# Altium schematic sheet AD7768_hall_crossboard_1_1.SchDoc
size A4
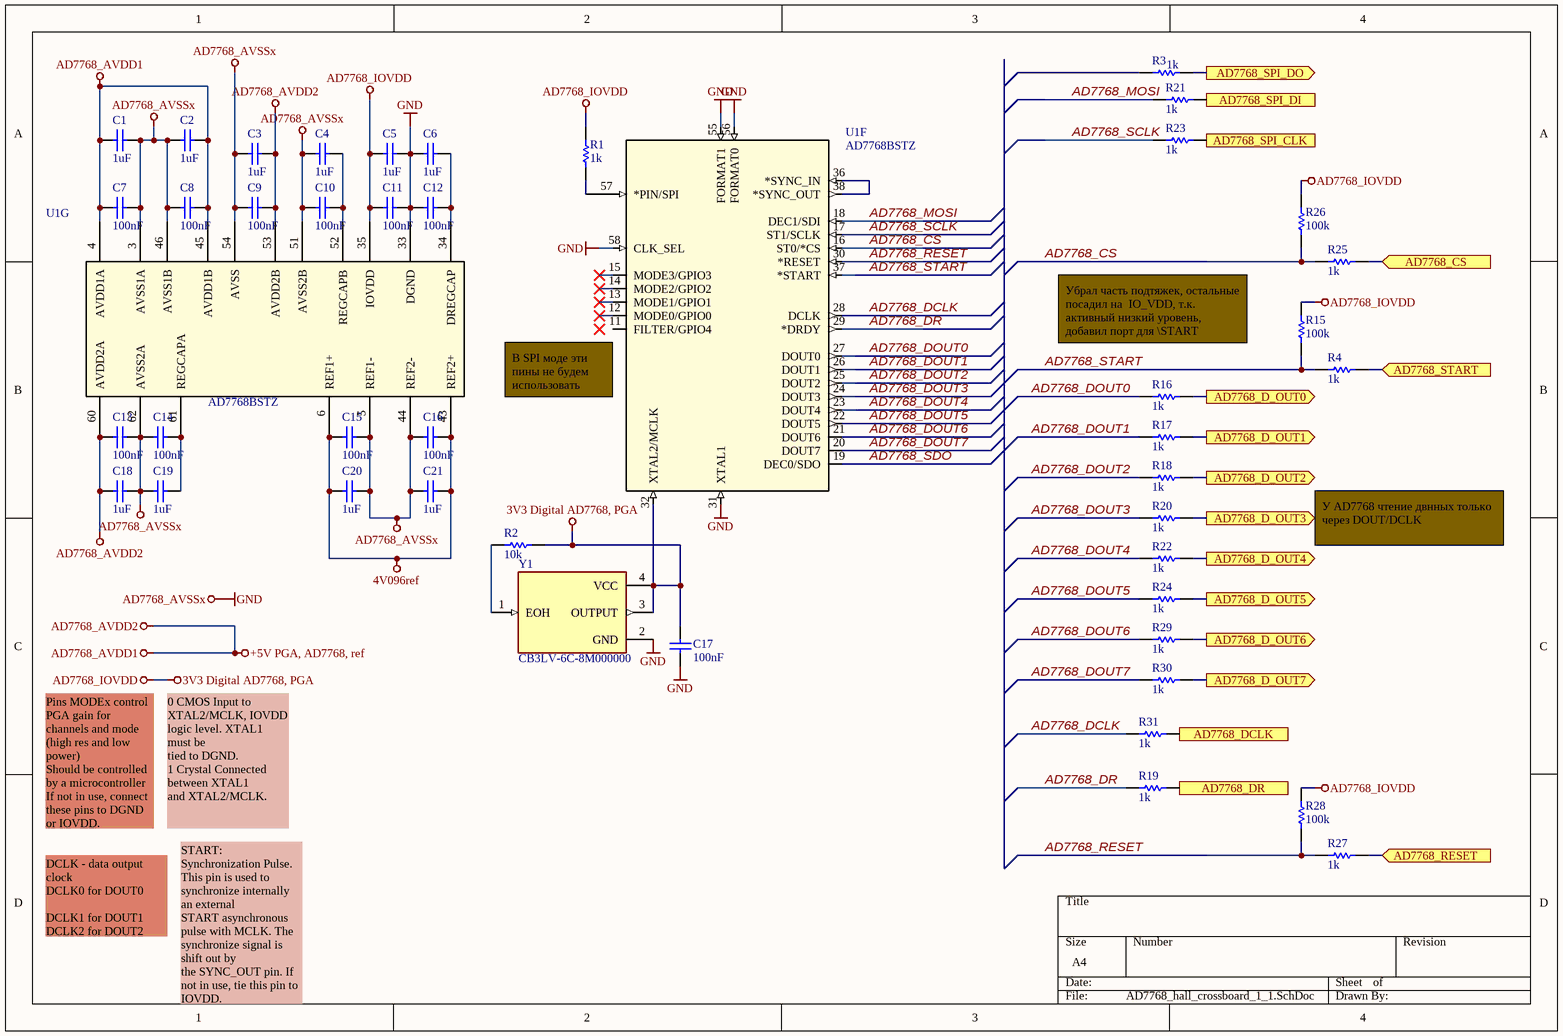
[diagram p0: AD7768_hall_crossboard_1_1.SchDoc]

## Parts
C1  1uF  [0805C]
C2  1uF  [0805C]
C3  1uF  [0805C]
C4  1uF  [0805C]
C5  1uF  [0805C]
C6  1uF  [0805C]
C7  100nF  [0603C]
C8  100nF  [0603C]
C9  100nF  [0603C]
C10  100nF  [0603C]
C11  100nF  [0603C]
C12  100nF  [0603C]
C13  100nF  [0603C]
C14  100nF  [0603C]
C15  100nF  [0603C]
C16  100nF  [0603C]
C17  100nF  [0603C]
C18  1uF  [0805C]
C19  1uF  [0805C]
C20  1uF  [0805C]
C21  1uF  [0805C]
R1  1k  [0603R]
R2  10k  [0603R]
R3  1k  [0603R]
R4  1k  [0603R]
R15  100k  [0603R]
R16  1k  [0603R]
R17  1k  [0603R]
R18  1k  [0603R]
R19  1k  [0603R]
R20  1k  [0603R]
R21  1k  [0603R]
R22  1k  [0603R]
R23  1k  [0603R]
R24  1k  [0603R]
R25  1k  [0603R]
R26  100k  [0603R]
R27  1k  [0603R]
R28  100k  [0603R]
R29  1k  [0603R]
R30  1k  [0603R]
R31  1k  [0603R]
U1  AD7768BSTZ  [ST-64-2_ADI-M]  (parts F,G of 7)
Y1  CB3LV-6C-8M000000  [OSC_CB3LV-6C-8M000000]

## Ports
AD7768_CS (in), AD7768_D_OUT0 (out), AD7768_D_OUT1 (out), AD7768_D_OUT2 (out), AD7768_D_OUT3 (out), AD7768_D_OUT4 (out), AD7768_D_OUT5 (out), AD7768_D_OUT6 (out), AD7768_D_OUT7 (out), AD7768_DCLK (out), AD7768_DR (out), AD7768_RESET (in), AD7768_SPI_CLK (in), AD7768_SPI_DI (in), AD7768_SPI_DO (out), AD7768_START (in)

## Nets
3V3 Digital AD7768, PGA: C5.2 C11.2 C17.2 R1.2 R2.2 R15.2 R26.2 R28.2 U1.32(XTAL2/MCLK) U1.35(IOVDD) Y1.3(OUTPUT) Y1.4(VCC)  [also labelled AD7768_IOVDD]
4V096ref: C15.1 C16.2 C20.1 C21.2 U1.6(REF1+) U1.43(REF2+)
+5V PGA, AD7768, ref: C1.1 C2.2 C3.2 C7.1 C8.2 C9.2 C13.1 C18.1 U1.4(AVDD1A) U1.45(AVDD1B) U1.53(AVDD2B) U1.60(AVDD2A)  [also labelled AD7768_AVDD1, AD7768_AVDD2]
AD7768_AVSSx: C1.2 C2.1 C3.1 C4.1 C5.1 C6.2 C7.2 C8.1 C9.1 C10.1 C11.1 C12.2 C13.2 C14.1 C15.2 C16.1 C17.1 C18.2 C19.1 C20.2 C21.1 U1.3(AVSS1A) U1.5(REF1-) U1.31(XTAL1) U1.33(DGND) U1.44(REF2-) U1.46(AVSS1B) U1.51(AVSS2B) U1.54(AVSS) U1.55(FORMAT1) U1.56(FORMAT0) U1.58(CLK_SEL) U1.62(AVSS2A) Y1.2(GND)  [also labelled GND]
AD7768_CS: R25.1 R26.1 U1.16(ST0/*CS)
AD7768_CS: R25.2 ; port AD7768_CS  [a separate net that carries the same name]
AD7768_D_OUT0: R16.2 ; port AD7768_D_OUT0
AD7768_D_OUT1: R17.2 ; port AD7768_D_OUT1
AD7768_D_OUT2: R18.2 ; port AD7768_D_OUT2
AD7768_D_OUT3: R20.2 ; port AD7768_D_OUT3
AD7768_D_OUT4: R22.2 ; port AD7768_D_OUT4
AD7768_D_OUT5: R24.2 ; port AD7768_D_OUT5
AD7768_D_OUT6: R29.2 ; port AD7768_D_OUT6
AD7768_D_OUT7: R30.2 ; port AD7768_D_OUT7
AD7768_DCLK: R31.1 U1.28(DCLK)
AD7768_DCLK: R31.2 ; port AD7768_DCLK  [a separate net that carries the same name]
AD7768_DOUT0: R16.1 U1.27(DOUT0)
AD7768_DOUT1: R17.1 U1.26(DOUT1)
AD7768_DOUT2: R18.1 U1.25(DOUT2)
AD7768_DOUT3: R20.1 U1.24(DOUT3)
AD7768_DOUT4: R22.1 U1.23(DOUT4)
AD7768_DOUT5: R24.1 U1.22(DOUT5)
AD7768_DOUT6: R29.1 U1.21(DOUT6)
AD7768_DOUT7: R30.1 U1.20(DOUT7)
AD7768_DR: R19.2 ; port AD7768_DR
AD7768_DR: R19.1 U1.29(*DRDY)  [a separate net that carries the same name]
AD7768_MOSI: R21.1 U1.18(DEC1/SDI)
AD7768_RESET: R27.1 R28.1 U1.30(*RESET)
AD7768_RESET: R27.2 ; port AD7768_RESET  [a separate net that carries the same name]
AD7768_SCLK: R23.1 U1.17(ST1/SCLK)
AD7768_SDO: U1.19(DEC0/SDO)
AD7768_SPI_CLK: R23.2 ; port AD7768_SPI_CLK
AD7768_SPI_DI: R21.2 ; port AD7768_SPI_DI
AD7768_SPI_DO: R3.2 ; port AD7768_SPI_DO
AD7768_START: R4.2 ; port AD7768_START
AD7768_START: R4.1 R15.1 U1.37(*START)  [a separate net that carries the same name]
NetC4_2: C4.2 C10.2 U1.52(REGCAPB)
NetC6_1: C6.1 C12.1 U1.34(DREGCAP)
NetC14_2: C14.2 C19.2 U1.61(REGCAPA)
NetR1_1: R1.1 U1.57(*PIN/SPI)
NetR2_1: R2.1 Y1.1(EOH)
NetU1_36: U1.36(*SYNC_IN) U1.38(*SYNC_OUT)

Not connected (* = marked no-connect by the designer): R3 1; U1 11(FILTER/GPIO4) 12(MODE0/GPIO0)* 13(MODE1/GPIO1)* 14(MODE2/GPIO2)* 15(MODE3/GPIO3)*

## Notes on the sheet
- Убрал часть подтяжек, остальные посадил на  IO_VDD, т.к. активный низкий уровень, добавил порт для \START
- (near U1) В SPI моде эти пины не будем использовать
- У AD7768 чтение двнных только через DOUT/DCLK
- Pins MODEx control PGA gain for channels and mode (high res and low power)
  Should be controlled by a microcontroller
  If not in use, connect these pins to DGND or IOVDD.
- 0 CMOS Input to XTAL2/MCLK, IOVDD
  logic level. XTAL1 must be
  tied to DGND.
  1 Crystal Connected between XTAL1
  and XTAL2/MCLK.
- DCLK - data output clock
  DCLK0 for DOUT0
  DCLK1 for DOUT1
  DCLK2 for DOUT2
- START: Synchronization Pulse. This pin is used to synchronize internally an external
  START asynchronous pulse with MCLK. The synchronize signal is shift out by
  the SYNC_OUT pin. If not in use, tie this pin to IOVDD.

## Library data of the parts
C1-C21 = Capacitor_ST: Capacitor 0402 / 0603 / 0805; Revision: July-2002: Re-released for DXP Platform.
  C1-C6 C18-C21: Value: 1uF
  C7-C17: Value: 100nF
R1-R4 R15-R31 = Resistor_ST: Resistor 0402 / 0603 / 0805
  R1 R3 R4 R16-R25 R27 R29-R31: Value: 1k
  R2: Value: 10k
  R15 R26 R28: Value: 100k
U1 = AD7768BSTZ: No Description Available; Mfr_Name: Analog Devices Inc; Type: Data Acquisition; RefDes: RefDes
Y1 = CB3LV-6C-8M000000: 8 MHz XO (Standard) HCMOS, TTL Oscillator 3.3V Enable/Disable 4-SMD, No Lead; MF: CTS-Frequency Controls; SnapEDA_Link: https://www.snapeda.com/parts/CB3LV-6C-8M000000/CTS-Frequency+Controls/view-part/?ref=snap; Package: NON STANDARD-4 CTS; Value: *; MP: CB3LV-6C-8M000000; Check_prices: https://www.snapeda.com/parts/CB3LV-6C-8M000000/CTS-Frequency+Controls/view-part/?ref=eda